# EAGLE design Adafruit Flora BLE Friend (EAGLE 6.6.0)
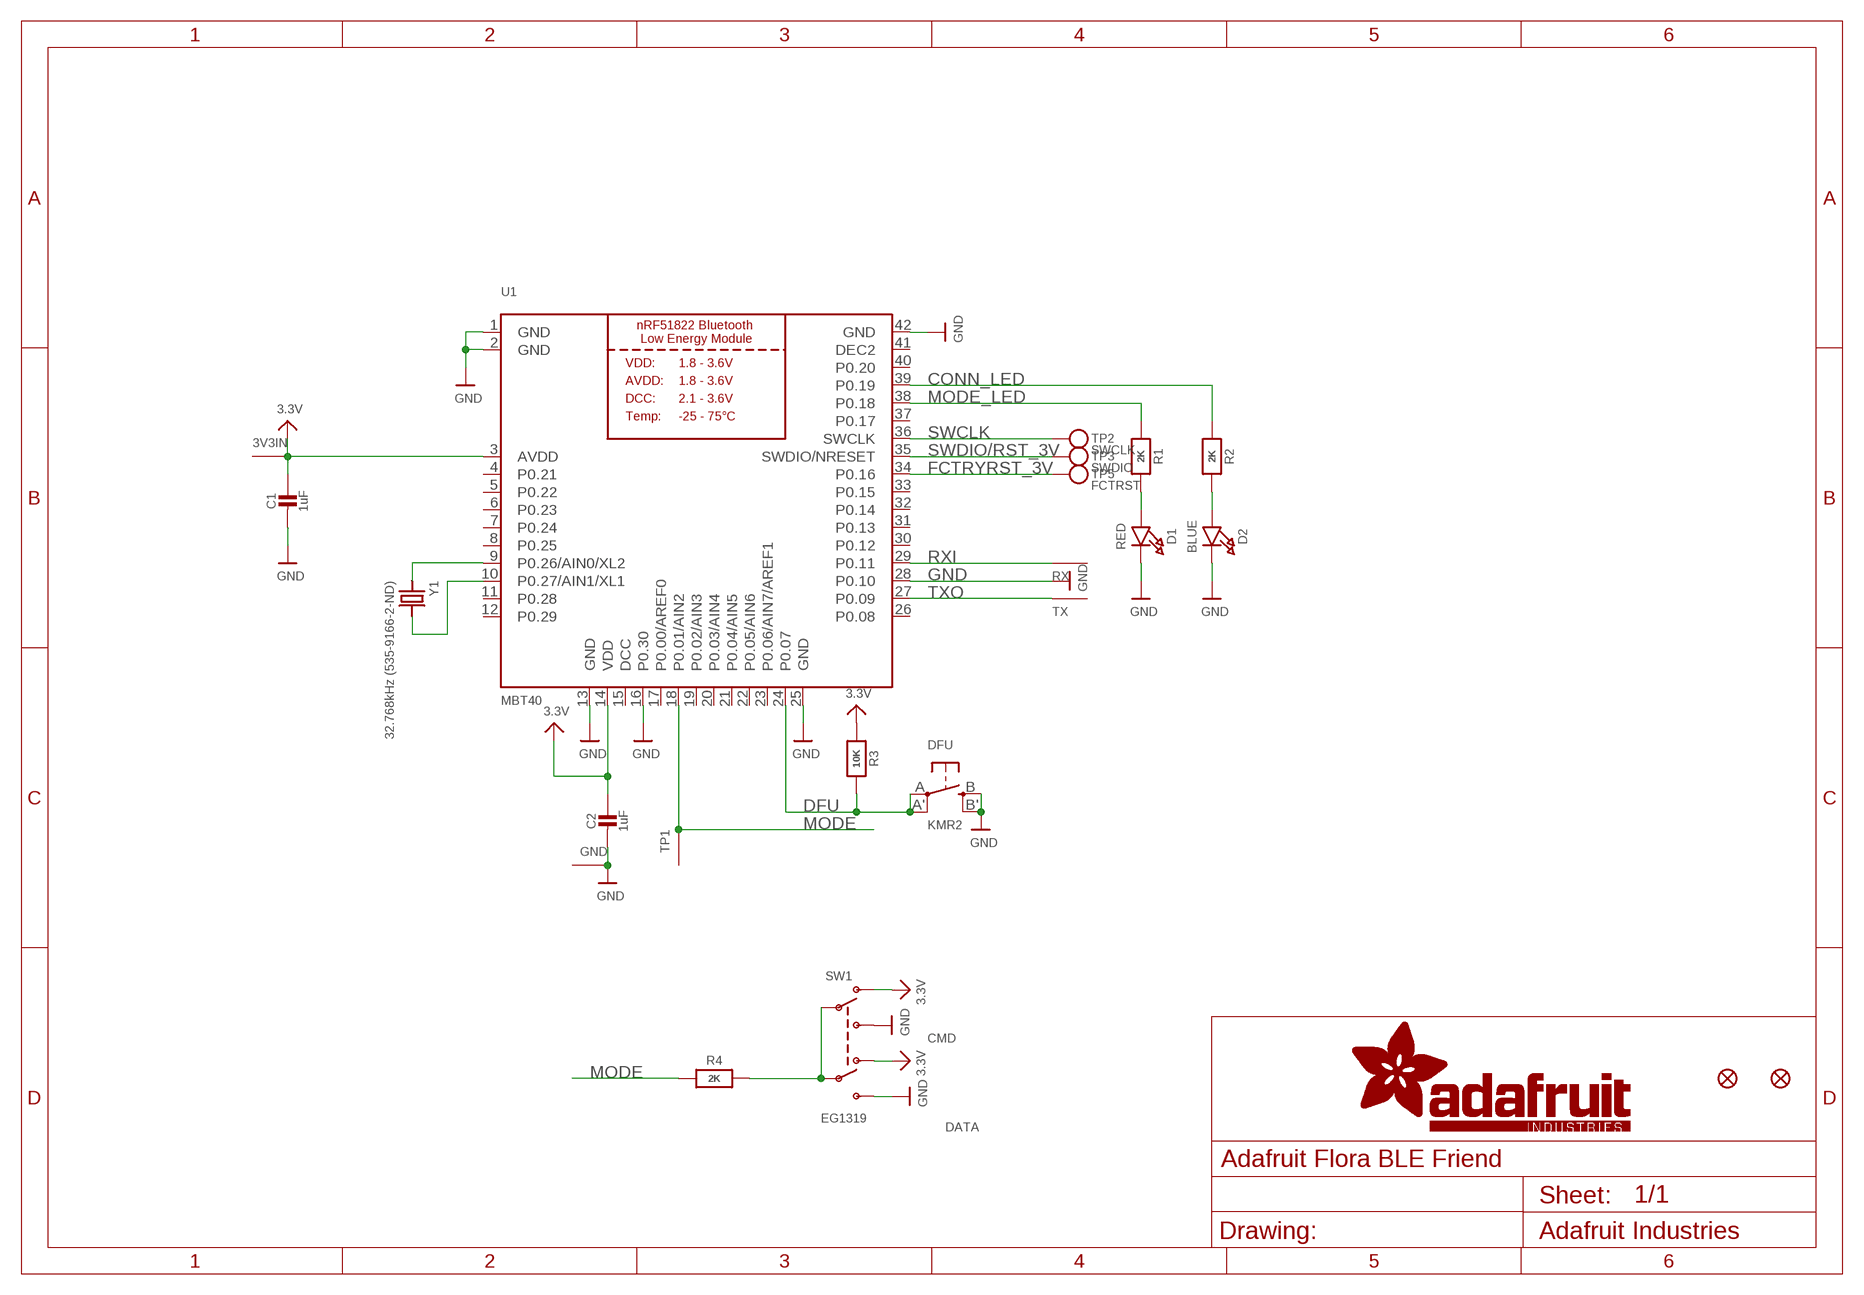
[diagram p0: schematic, sheet 1]

## Parts
3V3IN  SEWTAP-2.0IN  [SEWINGTAP_2.0]
C1  1uF  CAP_CERAMIC0805-NOOUTLINE  [0805-NO]
C2  1uF  CAP_CERAMIC0805-NOOUTLINE  [0805-NO]
D1  RED  LED0805_NOOUTLINE  [CHIPLED_0805_NOOUTLINE]
D2  BLUE  LED0805_NOOUTLINE  [CHIPLED_0805_NOOUTLINE]
DFU  KMR2  SWITCH_TACT_SMT4.6X2.8  [BTN_KMR2_4.6X2.8]
FID1  FIDUCIAL""  [FIDUCIAL_1MM]
FID2  FIDUCIAL""  [FIDUCIAL_1MM]
GND  SEWTAP-2.0IN  [SEWINGTAP_2.0]
R1  2K  RESISTOR0805_NOOUTLINE  [0805-NO]
R2  2K  RESISTOR0805_NOOUTLINE  [0805-NO]
R3  10K  RESISTOR0805_NOOUTLINE  [0805-NO]
R4  2K  RESISTOR0805_NOOUTLINE  [0805-NO]
RX  SEWTAP-2.0IN  [SEWINGTAP_2.0]
SW1  EG1319  SWITCH_DPDTEG1390  [EG1390]
TP1  SEWTAP-2.0IN  [SEWINGTAP_2.0]
TP2  SWCLK  TESTPOINT1.5X2.0MM_NOCREAM  [PAD-1.5X2.0]
TP3  SWDIO  TESTPOINT1.5X2.0MM_NOCREAM  [PAD-1.5X2.0]
TP5  FCTRST  TESTPOINT1.5X2.0MM_NOCREAM  [PAD-1.5X2.0]
TX  SEWTAP-2.0IN  [SEWINGTAP_2.0]
U1  MBT40  NRF51822_MODULE_MDBT40  [BLE_MODULE_RAYTAC_MDBT40]
Y1  32.768kHz (535-9166-2-ND)  CRYSTAL2.0X6.0_32.768  [CRYSTAL_CYL_2X6MM_SMT]

## Nets
3.3V: 3V3IN.P$1(SEW) C1.1 C2.1 R3.1 SW1.O1 SW1.O2 U1.3(AVDD) U1.14(VDD)
CONN_LED: R2.1 U1.39(P0.19)
DFU: DFU.A'(P1) DFU.A(P) R3.2 U1.24(P0.07)
FCTRYRST_3V: TP5.P$1 U1.34(P0.16)
GND: C1.2 C2.2 D1.C D2.C DFU.B'(S1) DFU.B(S) GND.P$1(SEW) SW1.S1 SW1.S2 U1.1(GND) U1.2(GND) U1.13(GND) U1.16(P0.30) U1.25(GND) U1.28(P0.10) U1.42(GND)
MODE: R4.1 TP1.P$1(SEW) U1.18(P0.01/AIN2)
MODE_LED: R1.1 U1.38(P0.18)
N$1: R4.2 SW1.P1 SW1.P2
N$5: D1.A R1.2
N$6: D2.A R2.2
N$7: U1.9(P0.26/AIN0/XL2) Y1.1
N$8: U1.10(P0.27/AIN1/XL1) Y1.2
RXI: RX.P$1(SEW) U1.29(P0.11)
SWCLK: TP2.P$1 U1.36(SWCLK)
SWDIO/RST_3V: TP3.P$1 U1.35(SWDIO/NRESET)
TXO: TX.P$1(SEW) U1.27(P0.09)
Unconnected: U1.4(P0.21) U1.5(P0.22) U1.6(P0.23) U1.7(P0.24) U1.8(P0.25) U1.11(P0.28) U1.12(P0.29) U1.17(P0.00/AREF0) U1.19(P0.02/AIN3) U1.20(P0.03/AIN4) U1.21(P0.04/AIN5) U1.22(P0.05/AIN6) U1.23(P0.06/AIN7/AREF1) U1.26(P0.08) U1.30(P0.12) U1.31(P0.13) U1.32(P0.14) U1.33(P0.15) U1.37(P0.17) U1.40(P0.20)

## Notes on the sheet
- CMD
- DATA

## Power pins joined to a net without a drawn wire
DCC: U1.15(DCC)
DEC2: U1.41(DEC2)

## Library data of the parts
3V3IN GND RX TP1 TX = adafruit:SEWTAP
C1 C2 = microbuilder:CAP_CERAMIC: Ceramic Capacitors For new designs, use the packages preceded by an '_' character since they are more reliable: The following footprints should be used on most boards: _0402 - Standard footprint for regular board layouts _0603 - Standard footprint for regular board layouts _0805 - Standard footprint for regular board layouts _1206 - Standard footprint for regular board layouts For extremely tight-pitch boards where space is at a premium, the following 'micro-pitch' footprints can be used (smaller pads, no silkscreen outline, etc.): _0402MP - Micro-pitch footprint for very dense/compact boards _0603MP - Micro-pitch footprint for very dense/compact boards _0805MP - Micro-pitch footprint for very dense/compact boards _1206MP - Micro-pitch footprint for very dense/compact boards
D1 D2 = microbuilder:LED: LED 0603 - 0603 Surface Mount Package 2mA: Green LED - Low Power (3.9mcd, 2ma, 1.7Vf) - Digikey: 475-2709-2-ND Orange LED - Low Power (9.8mcd, 2ma, 1.8Vf) - Digikey: 475-1194-2-ND Red LED - Low Power (5mcd, 2ma, 1.8Vf) - Digikey: 475-1195-2-ND Yellow LED - Low Power (7mcd, 2ma, 1.8Vf) - Digikey: 475-1196-2-ND 5mA: Blue LED - Low Power (17mcd, 5ma, 2.9Vf) - Digikey: LNJ937W8CRACT-ND 0805 - 0805 Surface Mount Package 2mA: Red LED (8.8mcd, 2mA, 1.8Vf, Clear) - Low Power [Digikey: 475-2510-1-ND] Green LED (5mcd, 2mA, 1.8Vf, Clear) - Low Power [Digikey: 475-2730-1-ND] Yellow LED (11.3mcd, 2mA, 1.8Vf, Clear) - Low Power [Digikey: 475-2555-1-ND] 20mA: Red LED (104mcd, 20mA, Diffused) - LS R976 [Digikey: 475-1278-6-ND] Red LED (12mcd, 20mA, 2.0Vf, Clear) - APT2012EC [Digikey: 754-1128-1-ND] Green LED (15mcd, 20mA, 2.2Vf, Clear) - APT2012GC [Digikey: 754-1131-1-ND] Orange LED (160mcd, 20mA, 2.1Vf, Clear) - APT2012SECK [Digikey: 754-1130-1-ND] 1206 - 1206 Surface Mount Package Green LED (26mcd, 20mA, Diffused) - LG N971 [Digikey: 475-1407-6-ND] Red LED (15mcd, 20mA, Diffused) - LH N974 [Digikey: 475-1416-6-ND] Cree - Cree High-Power Surface Mount LEDs XPEBWT-L1-0000-00D50 - White 111lm 350mA 2.9Vf 6200K 110° XTEAWT-00-0000-00000LEE3 - White 114lm 350mA 2.85Vf 5000K 115° Everlight - Everlight 45-21 Series Surface Mount LEDs 45-21/QK2C-B2832AC2CB2/2T - Warm White 2000mcd 20mA 3.25Vf 3050K 120° 45-21/LK2C-B38452C4CB2/2T - Nuetral White 2000mcd 20mA 3.25Vf 4150K 120° 45-21/LK2C-B50634C6CB2/2T - Cold White 2200mcd 20mA 3.25Vf 5650K 120° PLCC2 Reverse Mount LS T77K-J1L2-1-0-2-R18-Z - Red 11.25mcd 2mA 1.8Vf 630nm 120° LO T77K-L1M2-24-Z - Orange 19.6mcd 2mA 1.8Vf 606nm 120° LY T77K-K2M1-26-Z - Yellow 15.7mcd 2mA 1.8Vf 587nm 120°
DFU = microbuilder:SWITCH_TACT_SMT: SMT Tact Switches 6x6mm - Digikey: P12940SCT-ND KMR2 (4.6x2.8mm) - Digikey: 401-1426-1-ND EVQ-PQHB55 - Light Touch, 160GF (4.5x4.5mm) - Digikey: P8090SCT-ND KMT0 - KMT021 NGJ LHS (etc.) IP68/Waterproof - Digikey: CKN10289CT-ND
FID1 FID2 = microbuilder:FIDUCIAL: Fiducial Alignment Points Various fiducial points for machine vision alignment.; BOM: EXCLUDE
R1-R4 = microbuilder:RESISTOR: Resistors For new designs, use the packages preceded by an '_' character since they are more reliable: The following footprints should be used on most boards: _0402 - Standard footprint for regular board layouts _0603 - Standard footprint for regular board layouts _0805 - Standard footprint for regular board layouts _1206 - Standard footprint for regular board layouts For extremely tight-pitch boards where space is at a premium, the following 'micro-pitch' footprints can be used (smaller pads, no silkscreen outline, etc.): _0402MP - Micro-pitch footprint for very dense/compact boards _0603MP - Micro-pitch footprint for very dense/compact boards _0805MP - Micro-pitch footprint for very dense/compact boards _1206MP - Micro-pitch footprint for very dense/compact boards
SW1 = microbuilder:SWITCH_DPDT: Switch - DPDT A DPDT Switch acts like an SPDT switch, but has a pair of switches instead of just one. Vertical - 0.3A @ 6V SMT - Digikey: JS202011SCQN
TP2 TP3 TP5 = microbuilder:TESTPOINT: Test Point Various test points for characterisation and PCB testing TESTPOINT_SMT - Compact Surface Mount Test Point [Digikey: 5016KTR-ND]
U1 = microbuilder:NRF51822_MODULE_MDBT40: nRF51822 Bluetooth Low Energy Module
Y1 = microbuilder:CRYSTAL: Crystals HC49UP - Surface Mount Crystal 4.0MHz 18pF +/-30ppm Surface Mount Crystal [Digikey: 535-9857-1-ND] 12.0 MHz Surface Mount Crystal [Digikey: 535-9869-6-ND] 25.0 MHz Surface Mount Crystal [Digikey: 535-9078-1-ND] 2.5 x 2.0mm - MEMs SMT Crystal 16.0 MHz 10pF 20ppm 2.5 x 2.0mm Crystal [Digikey -40-85°C: 535-10923-1-ND] 3.2 x 2.5mm - MEMs SMT Crystal 12.0 MHz 8pF 15ppm 3.2 x 2.5mm Crystal [Digikey: -10-70°C: 644-1047-1-ND -40-125°C: 644-1128-1-ND] 40~85°C cheaper: 644-1173-6-ND 16.0 MHz 8pF 15ppm 3.2 x 2.5mm Crystal [Digikey: -10-70°C: 644-1049-1-ND -40-125°C: 644-1129-2-ND]-40~85°C cheaper: 644-1175-6-ND 16.0 MHz 10pF 10ppm 3.2 x 2.5mm Crystal [Digikey: 644-1100-1-ND] 27.12 MHz 18pF 30ppm 3.2 x 2.5mm Crystal [Digikey: 887-1424-1-ND] 27.12MHz 10pF 10ppm 3.2 x 2.5mm Crystal [Digikey: 887-1329-1-ND] 4.9 x 1.8mm - MEMs SMT Crystal 32.768 KHz 12.5pF 20ppm 4.9 x 1.8mm Crystal [Digikey: SE2415CT-ND] 8.0 x 3.8mm - Surface Mount Crystal 32.768kHz 12.5pF 20ppm -40°C-85°C [Digikey: 535-9166-2-ND] Cylinder 32.768KHz Cylinder Crystal (2x6mm body) [Ex. Digikey: 300-8341-2-ND]

## Board
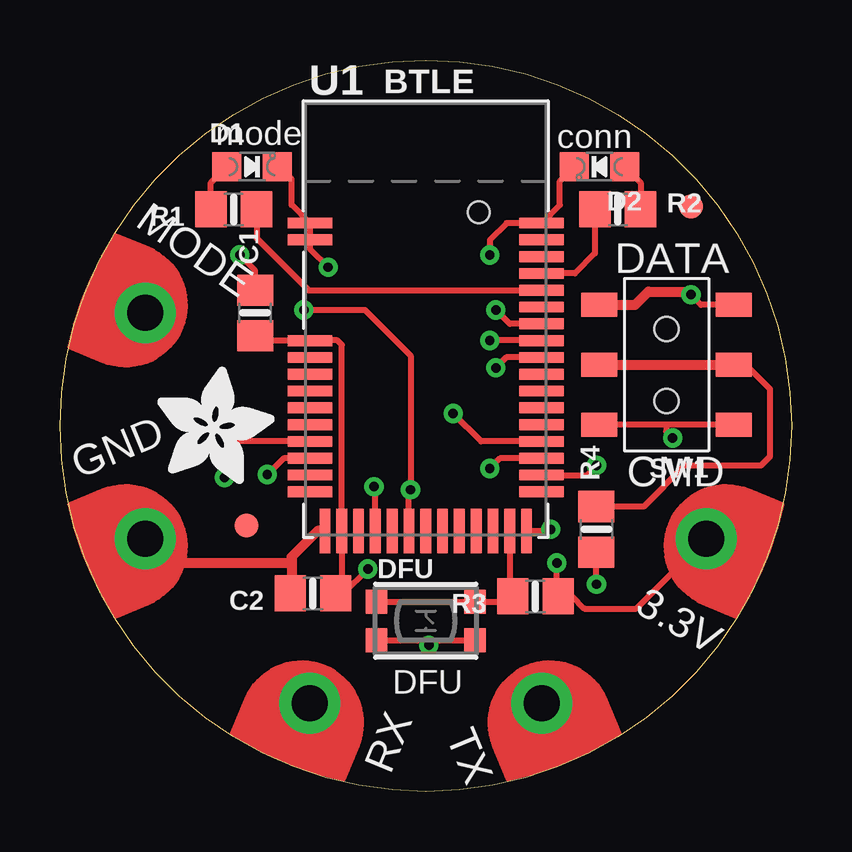
[diagram p1: board, top side]
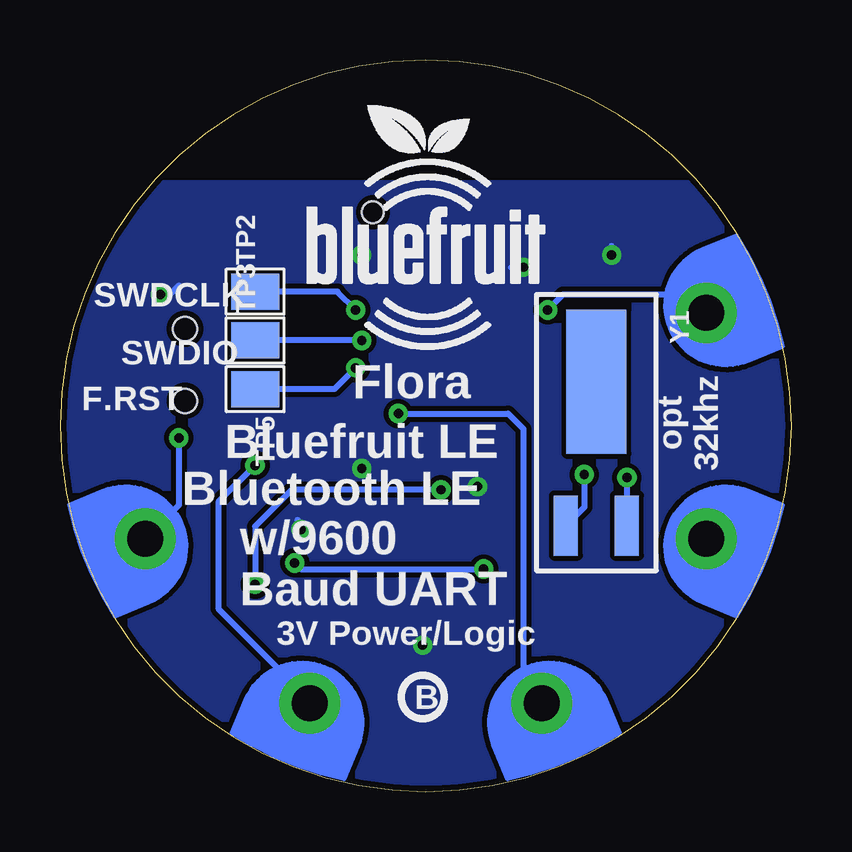
[diagram p2: board, bottom side, seen from below]

Size 30.48 x 30.48 mm. Coordinates in mm from the lower left corner, seen from the top.
Outline: 15.24,0 arc-90 0,15.24 arc-90 15.24,30.48 arc-90 30.48,15.24 arc-90 15.24,0
Copper layers (1*16): Top 0.035mm / dielectric 1.5mm / Bottom 0.035mm
Design rules "adafruit": minimum track width 8mil, minimum drill 15.5mil, track to track 8mil, track to pad 8mil, pad to pad 8mil, via to via 8mil, smd to smd 8mil, copper to edge 10mil, drill to drill 8mil, minimum pad ring 10mil, minimum via ring 8mil, stop-mask expansion 2mil, vias tented up to drill 20mil, thermal gap 10mil

### Footprints (pad centres in the part's own frame; a part is rotated, then mirrored left to right if it is on the bottom)
SEWINGTAP_2.0 = drill 1.5 pad 2.54: P$1 0,0
0805-NO = smd 1.3 x 1.5: 1 -0.95,0; 2 0.95,0
CHIPLED_0805_NOOUTLINE = smd 1.2 x 1.2: A 0,-1.05; C 0,1.05
BTN_KMR2_4.6X2.8 = smd 0.9 x 1: A 2.05,0.8; A' -2.05,0.8; B 2.05,-0.8; B' -2.05,-0.8
FIDUCIAL_1MM = smd 1 x 1: 1 0,0
EG1390 = smd 1 x 1.5: O1 -2.5,2.8; O2 -2.5,-2.8; P1 0,2.8; P2 0,-2.8; S1 2.5,2.8; S2 2.5,-2.8 | hole 1: 1.5,0; -1.5,0
PAD-1.5X2.0 = smd 1.5 x 2: P$1 0,0
BLE_MODULE_RAYTAC_MDBT40 = smd 1.85 x 0.45: 1 -4.825,4; 2 -4.825,3.3; 3 -4.825,-0.9; 4 -4.825,-1.6; 5 -4.825,-2.3; 6 -4.825,-3; 7 -4.825,-3.7; 8 -4.825,-4.4; 9 -4.825,-5.1; 10 -4.825,-5.8; 11 -4.825,-6.5; 12 -4.825,-7.2; 26 4.825,-7.2; 27 4.825,-6.5; 28 4.825,-5.8; 29 4.825,-5.1; 30 4.825,-4.4; 31 4.825,-3.7; 32 4.825,-3; 33 4.825,-2.3; 34 4.825,-1.6; 35 4.825,-0.9; 36 4.825,-0.2; 37 4.825,0.5; 38 4.825,1.2; 39 4.825,1.9; 40 4.825,2.6; 41 4.825,3.3; 42 4.825,4 | smd 0.45 x 1.85: 13 -4.2,-8.825; 14 -3.5,-8.825; 15 -2.8,-8.825; 16 -2.1,-8.825; 17 -1.4,-8.825; 18 -0.7,-8.825; 19 0,-8.825; 20 0.7,-8.825; 21 1.4,-8.825; 22 2.1,-8.825; 23 2.8,-8.825; 24 3.5,-8.825; 25 4.2,-8.825 | hole 0.9: 2.2,4.45
CRYSTAL_CYL_2X6MM_SMT = smd 2.5 x 1: 1 2.125,1.27; 2 2.125,-1.27 | smd 6 x 2.5: CYLINDER -3.875,0

### Placement (x,y rotation side)
3V3IN  26.92,10.54 247.5 top
C1  8.13,19.94 90 top
C2  10.54,8.25 180 top
D1  8,26.04 270 top
D2  22.48,26.04 90 top
DFU  15.24,7.11 0 top
FID1  26.29,24.38 0 top
FID2  7.77,11.09 0 top
GND  3.56,10.54 112.5 top
R1  7.24,24.26 180 top
R2  23.24,24.26 0 top
R3  19.81,8.13 180 top
R4  22.35,10.92 90 top
RX  10.41,3.68 157.5 top
SW1  25.27,17.78 90 top
TP1  3.56,19.94 67.5 top
TP2  22.35,20.83 90 bottom
TP3  22.35,18.8 90 bottom
TP5  22.35,16.76 270 bottom
TX  20.07,3.68 202.5 top
U1  15.24,19.69 0 top
U$6  [ADAFRUIT_5MM]  4.06,12.83 0 top
U$7  [FLORASMALL]  20.32,24.38 270 bottom
U$23  [BLUEFRUITLOGO_100MM]  20.19,18.41 0 bottom
U$24  [PCBFEAT-REV-040]  15.37,3.94 0 bottom
Y1  8.13,13.21 270 bottom

### Tracks (layer width: path | path; a pad name or v marks a point on that pad's centre or on a via)
3.3V  (via drill 0.39)
  Top 0.254: C1.1 8.33,18.79 U1.3 10.43,18.8 11.56,18.8 11.74,18.61 U1.14 11.74,8.5 C2.1 11.81,8.25 v12.83,9.27 | 28.07,11.69 3V3IN.P$1 24,7.62 21.84,7.62 21.34,8.13 R3.1 20.7,8.19 v20.7,9.53 | SW1.O2 25.26,15.28 | 25.26,15.28 SW1.O1 | 25.26,15.28 25.26,15 v25.53,14.73
  Bottom 0.254: v20.7,9.53 20.45,9.27 v12.83,9.27 | v25.53,14.73 25.53,11.94 3V3IN.P$1
CONN_LED
  Top 0.254: R2.1 22.29,22.42 21.46,21.59 U1.39
DFU
  Top 0.254: DFU.A' DFU.A 18.65,7.91 R3.2 18.74,8.25 U1.24
FCTRYRST_3V  (via drill 0.39)
  Top 0.254: U1.34 18.59,18.09 v18.16,17.65
  Bottom 0.254: v18.16,17.65 19.05,16.76 TP5.P$1
GND  (via drill 0.39)
  Top 0.254: D2.C 20.83,25.43 20.83,24.45 U1.42 18.61,23.69 17.91,22.99 v17.91,22.35 | D1.C 9.14,26.04 9.65,25.53 9.65,24.45 U1.1 U1.2 10.41,22.61 v11.18,21.84 | C1.2 8.13,21.72 v7.49,22.35 | U1.16 13.14,12.64 v13.08,12.7 | DFU.B' 15.16,6.31 | 15.16,6.31 DFU.B | 15.16,6.31 v15.37,6.11 v15.37,6.1 | SW1.S2 26.71,20.28 v26.29,20.7 | U1.25 20.38,10.86 v20.45,10.92 | U1.28 18.33,13.88 v17.91,13.46
  Top 0.406: U1.13 10.73,10.86 9.65,9.78 9.65,9.53 | 9.65,9.53 9.65,8.32 C2.2 | GND.P$1 4.7,9.53 9.65,9.53 | SW1.S1 23.96,20.28 24.51,20.83 26.16,20.83 v26.29,20.7
  Bottom 0.254: v7.49,22.35 7.49,22.73 | v11.18,21.84 11.68,21.84 | v13.08,12.7 13.34,12.7 | v15.37,6.1 15.37,5.84 | v26.29,20.7 25.91,20.7 25.53,21.08 | v17.91,22.35 18.03,22.35 18.16,22.23 | v20.45,10.92 20.45,11.18 20.57,11.3 | v17.91,13.46 17.65,13.46
  pour Bottom: 3.94,25.27 arc90 0,15.24 0,14.48 arc90 14.61,-0.13 15.62,-0.13 arc90 30.48,14.73 30.48,16.13 arc90 26.8,25.27
MODE  (via drill 0.39)
  Top 0.254: U1.18 14.54,12.51 v14.61,12.57 14.61,18.16 12.7,20.07 v10.16,20.07 | v22.35,8.64 R4.1
  Bottom 0.254: v14.61,12.57 20.83,12.57 22.35,11.05 v22.35,8.64 | TP1.P$1 4.32,20.7 9.53,20.7 v10.16,20.07
MODE_LED
  Top 0.254: R1.1 8.19,23.05 10.36,20.88 U1.38
N$1
  Top 0.254: R4.2 24.32,11.87 26.04,13.59 29.21,13.59 29.59,13.97 29.59,16.76 28.7,17.65 27.69,17.65 27.56,17.78
  Top 0.406: SW1.P1 27.56,17.78 SW1.P2
N$5
  Top 0.254: R1.2 6.29,25.37 D1.A
N$6
  Top 0.254: D2.A 24.19,25.37 R2.2
N$7  (via drill 0.39)
  Top 0.254: U1.9 7.35,14.59 6.86,14.1 v6.86,13.08
  Bottom 0.254: v6.86,13.08 Y1.1
N$8  (via drill 0.39)
  Top 0.254: U1.10 9.31,13.88 v8.64,13.21
  Bottom 0.254: v8.64,13.21 8.64,11.85 Y1.2
RXI  (via drill 0.39)
  Top 0.254: U1.29 17.55,14.59 v16.38,15.75
  Bottom 0.254: v16.38,15.75 11.81,15.75 11.18,15.11 11.18,4.32 10.79,3.94 10.67,3.94 RX.P$1
SWCLK  (via drill 0.39)
  Top 0.254: U1.36 18.74,19.48 v18.16,20.07
  Bottom 0.254: v18.16,20.07 18.92,20.83 TP2.P$1
SWDIO/RST_3V  (via drill 0.39)
  Top 0.254: U1.35 20.05,18.8 v17.91,18.8
  Bottom 0.254: v17.91,18.8 TP3.P$1
TXO  (via drill 0.39)
  Top 0.254: U1.27 21.95,13.19 v22.35,13.59
  Bottom 0.254: v22.35,13.59 23.88,12.07 23.88,7.62 20.07,3.81 TX.P$1

### Text on the board
tPlace: BTLE | mode | conn | MODE | DATA | GND | CMD | 3.3V | DFU | RX | TX
bPlace: SWDCLK | SWDIO | Flora | F.RST | opt / 32khz | Bluefruit LE | Bluetooth LE | w/9600 / Baud UART | 3V Power/Logic